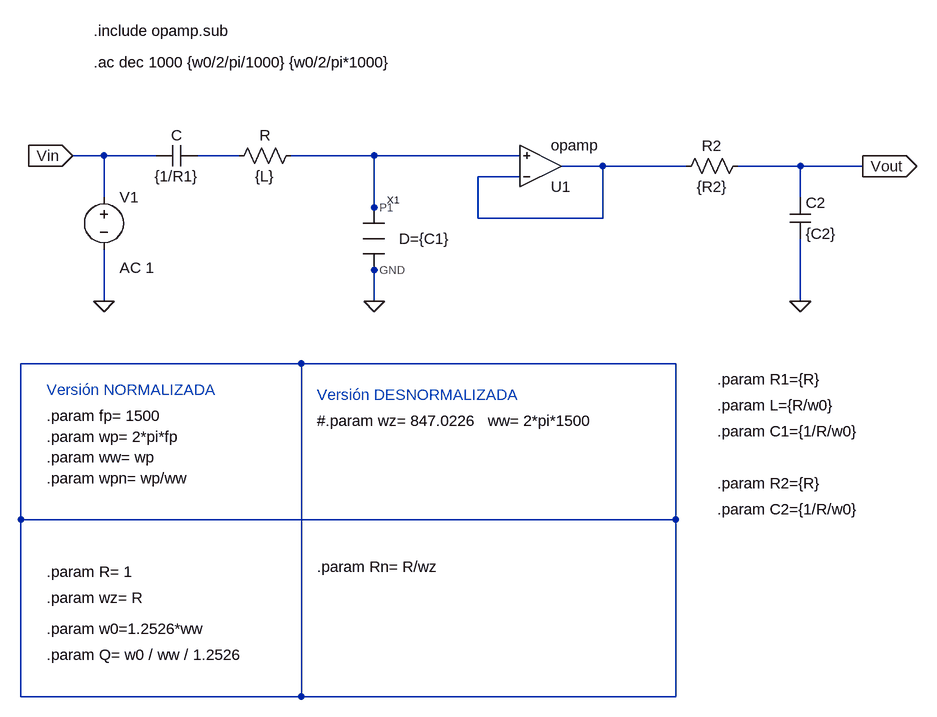
[diagram p0: schematic TS3_LTSpice_FDNR.asc]
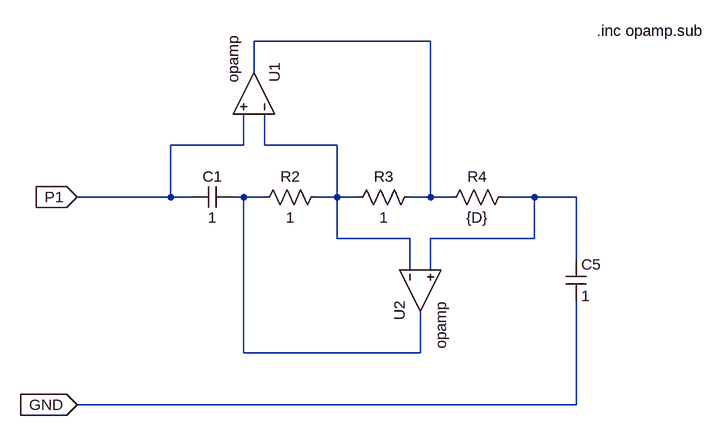
[diagram p1: sub-circuit fdnr.asc]
TS3_LTSpice_FDNR.asc, the LTspice schematic file:
Version 4
SHEET 1 1836 888
WIRE -400 -208 -448 -208
WIRE -320 -208 -400 -208
WIRE -192 -208 -256 -208
WIRE 16 -208 -112 -208
WIRE 240 -208 16 -208
WIRE 368 -192 304 -192
WIRE 496 -192 368 -192
WIRE 672 -192 576 -192
WIRE 768 -192 672 -192
WIRE 240 -176 176 -176
WIRE -400 -144 -400 -208
WIRE 672 -144 672 -192
WIRE 16 -128 16 -208
WIRE 16 -112 16 -128
WIRE 176 -112 176 -176
WIRE 368 -112 368 -192
WIRE 368 -112 176 -112
WIRE 16 -32 16 -48
WIRE -400 16 -400 -64
WIRE 16 16 16 -32
WIRE 672 16 672 -80
WIRE -96 112 -528 112
WIRE 480 112 -96 112
WIRE -528 352 -528 112
WIRE 480 352 480 112
WIRE 480 352 -528 352
WIRE -528 624 -528 352
WIRE -96 624 -96 112
WIRE -96 624 -528 624
WIRE 480 624 480 352
WIRE 480 624 -96 624
FLAG 16 16 0
FLAG -400 16 0
FLAG -448 -208 Vin
IOPIN -448 -208 In
FLAG 672 16 0
FLAG 768 -192 Vout
IOPIN 768 -192 Out
SYMBOL Opamps\\opamp 272 -128 M180
SYMATTR InstName U1
SYMBOL res -96 -224 R90
WINDOW 0 0 56 VBottom 2
WINDOW 3 32 56 VTop 2
SYMATTR InstName R
SYMATTR Value {L}
SYMBOL cap -256 -224 R90
WINDOW 0 0 32 VBottom 2
WINDOW 3 32 32 VTop 2
SYMATTR InstName C
SYMATTR Value {1/R1}
SYMBOL res 592 -208 R90
WINDOW 0 0 56 VBottom 2
WINDOW 3 32 56 VTop 2
SYMATTR InstName R2
SYMATTR Value {R2}
SYMBOL cap 656 -144 R0
SYMATTR InstName C2
SYMATTR Value {C2}
SYMBOL voltage -400 -160 R0
WINDOW 123 24 124 Left 2
WINDOW 39 0 0 Left 0
SYMATTR Value2 AC 1
SYMATTR InstName V1
SYMATTR Value ""
SYMBOL FDNR 16 -80 R0
WINDOW 39 38 0 Left 2
SYMATTR SpiceLine D={C1}
SYMATTR InstName X1
TEXT -416 -400 Left 2 !.include opamp.sub
TEXT -416 -352 Left 2 !.ac dec 1000 {w0/2/pi/1000} {w0/2/pi*1000}
TEXT -488 152 Left 2 ;Versión NORMALIZADA
TEXT -488 472 Left 2 !.param wz= R
TEXT -72 160 Left 2 ;Versión DESNORMALIZADA
TEXT -72 200 Left 2 !#.param wz= 847.0226   ww= 2*pi*1500
TEXT 544 136 Left 2 !.param R1={R}
TEXT -488 520 Left 2 !.param w0=1.2526*ww
TEXT 544 336 Left 2 !.param C2={1/R/w0}
TEXT 544 176 Left 2 !.param L={R/w0}
TEXT 544 296 Left 2 !.param R2={R}
TEXT 544 216 Left 2 !.param C1={1/R/w0}
TEXT -488 560 Left 2 !.param Q= w0 / ww / 1.2526
TEXT -72 424 Left 2 !.param Rn= R/wz
TEXT -488 288 Left 2 !.param wpn= wp/ww
TEXT -488 224 Left 2 !.param wp= 2*pi*fp
TEXT -488 192 Left 2 !.param fp= 1500
TEXT -488 256 Left 2 !.param ww= wp
TEXT -488 432 Left 2 !.param R= 1

fdnr.asc, the sub-circuit schematic file:
Version 4
SHEET 1 880 680
WIRE 336 -48 64 -48
WIRE 64 0 64 -48
WIRE 48 112 48 64
WIRE 48 112 -64 112
WIRE 80 112 80 64
WIRE 192 112 80 112
WIRE -64 192 -64 112
WIRE -64 192 -208 192
WIRE -32 192 -64 192
WIRE 48 192 32 192
WIRE 80 192 48 192
WIRE 192 192 192 112
WIRE 192 192 160 192
WIRE 224 192 192 192
WIRE 336 192 336 -48
WIRE 336 192 304 192
WIRE 368 192 336 192
WIRE 496 192 448 192
WIRE 560 192 496 192
WIRE 192 256 192 192
WIRE 304 256 192 256
WIRE 496 256 496 192
WIRE 496 256 336 256
WIRE 560 288 560 192
WIRE 304 304 304 256
WIRE 336 304 336 256
WIRE 48 432 48 192
WIRE 320 432 320 368
WIRE 320 432 48 432
WIRE 560 512 560 352
WIRE 560 512 -208 512
FLAG -208 192 P1
IOPIN -208 192 In
FLAG -208 512 GND
IOPIN -208 512 In
SYMBOL Opamps\\opamp 128 32 M270
SYMATTR InstName U1
SYMBOL Opamps\\opamp 256 336 M90
SYMATTR InstName U2
SYMBOL cap 32 176 R90
WINDOW 0 0 32 VBottom 2
WINDOW 3 32 32 VTop 2
SYMATTR InstName C1
SYMATTR Value 1
SYMBOL cap 544 288 R0
SYMATTR InstName C5
SYMATTR Value 1
SYMBOL res 176 176 R90
WINDOW 0 0 56 VBottom 2
WINDOW 3 32 56 VTop 2
SYMATTR InstName R2
SYMATTR Value 1
SYMBOL res 320 176 R90
WINDOW 0 0 56 VBottom 2
WINDOW 3 32 56 VTop 2
SYMATTR InstName R3
SYMATTR Value 1
SYMBOL res 464 176 R90
WINDOW 0 0 56 VBottom 2
WINDOW 3 32 56 VTop 2
SYMATTR InstName R4
SYMATTR Value {D}
TEXT 592 -64 Left 2 !.inc opamp.sub

The netlist it stands for:
* TS3_LTSpice_FDNR.asc
XU1 N003 N002 N003 opamp Aol=100K GBW=10Meg  ; pins invin noninvin out
R N002 N001 {L}
C N001 Vin {1/R1}
R2 Vout N003 {R2}
C2 Vout 0 {C2}
V1 Vin 0 AC 1
XX1 N002 0 fdnr params: D={C1}

* block symbol definitions
.subckt fdnr P1 GND
XU1 N002 P1 N001 opamp Aol=100K GBW=10Meg  ; pins invin noninvin out
XU2 N002 N004 N003 opamp Aol=100K GBW=10Meg  ; pins invin noninvin out
C1 N003 P1 1
C5 N004 GND 1
R2 N002 N003 1
R3 N001 N002 1
R4 N004 N001 {D}
.inc opamp.sub
.ends fdnr

.include opamp.sub
.ac dec 1000 {w0/2/pi/1000} {w0/2/pi*1000}
* Versión NORMALIZADA
.param wz= R
* Versión DESNORMALIZADA
#.param wz= 847.0226   ww= 2*pi*1500
.param R1={R}
.param w0=1.2526*ww
.param C2={1/R/w0}
.param L={R/w0}
.param R2={R}
.param C1={1/R/w0}
.param Q= w0 / ww / 1.2526
.param Rn= R/wz
.param wpn= wp/ww
.param wp= 2*pi*fp
.param fp= 1500
.param ww= wp
.param R= 1
.backanno
.end